# Altium schematic sheet PCI Express_16765X6890_98PIN_Low profile.schdoc: PCI Express x8 Top Sheet
size A4; SheetNumber: 1; SheetTotal: 2
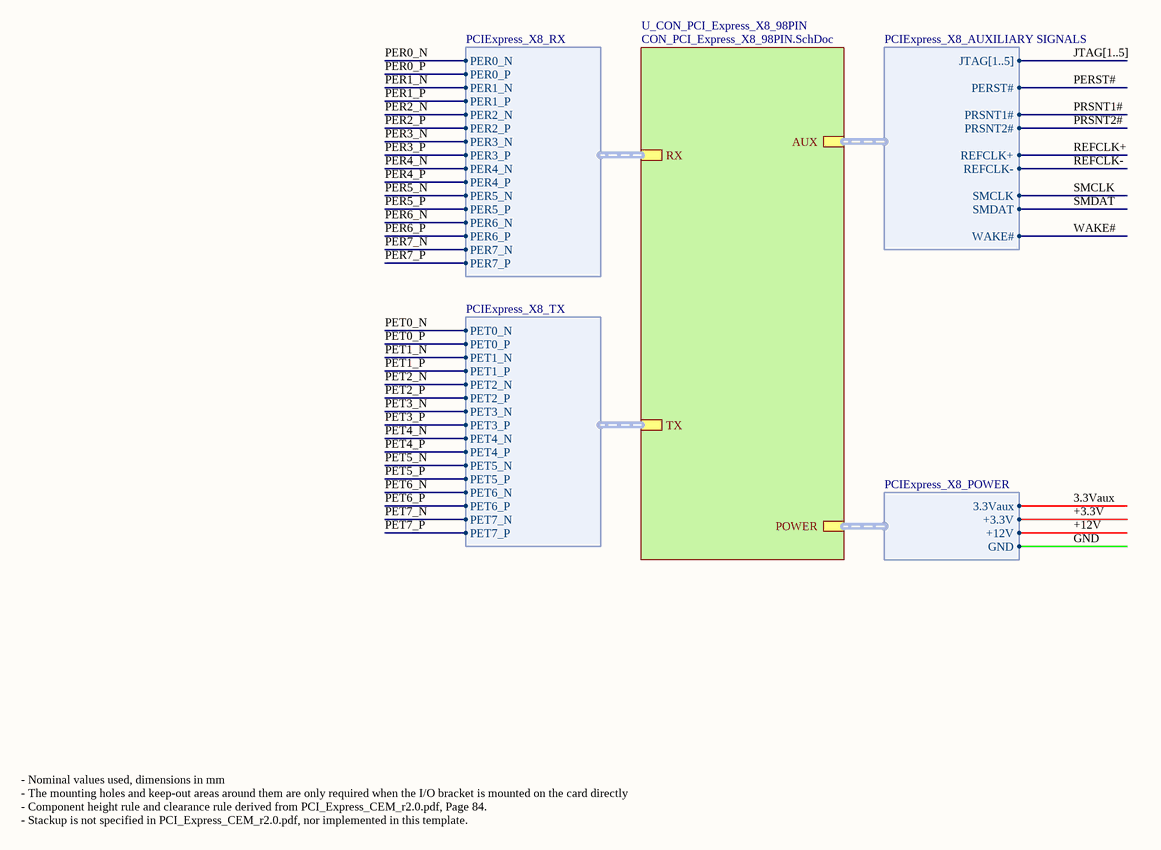
[diagram p0: PCI Express_16765X6890_98PIN_Low profile.schdoc]

## Sub-sheets
U_CON_PCI_Express_X8_98PIN = CON_PCI_Express_X8_98PIN.SchDoc: POWER (harness PCIExpress_X8_POWER), AUX (harness PCIExpress_X8_AUXILIARY SIGNALS), RX (harness PCIExpress_X8_RX), TX (harness PCIExpress_X8_TX)

## Harnesses
PCIExpress_X8_RX: PER0_N, PER0_P, PER1_N, PER1_P, PER2_N, PER2_P, PER3_N, PER3_P, PER4_N, PER4_P, PER5_N, PER5_P, PER6_N, PER6_P, PER7_N, PER7_P
PCIExpress_X8_TX: PET0_N, PET0_P, PET1_N, PET1_P, PET2_N, PET2_P, PET3_N, PET3_P, PET4_N, PET4_P, PET5_N, PET5_P, PET6_N, PET6_P, PET7_N, PET7_P
PCIExpress_X8_POWER: +3.3V, +12V, GND, 3.3Vaux
PCIExpress_X8_AUXILIARY SIGNALS: JTAG[1..5], PERST#, PRSNT1#, PRSNT2#, REFCLK+, REFCLK-, SMCLK, SMDAT, WAKE#

## Nets
3.3Vaux: sheet U_CON_PCI_Express_X8_98PIN/POWER.3.3Vaux
+3.3V: sheet U_CON_PCI_Express_X8_98PIN/POWER.+3.3V
+12V: sheet U_CON_PCI_Express_X8_98PIN/POWER.+12V
GND: sheet U_CON_PCI_Express_X8_98PIN/POWER.GND
PER0_N: sheet U_CON_PCI_Express_X8_98PIN/RX.PER0_N
PER0_P: sheet U_CON_PCI_Express_X8_98PIN/RX.PER0_P
PER1_N: sheet U_CON_PCI_Express_X8_98PIN/RX.PER1_N
PER1_P: sheet U_CON_PCI_Express_X8_98PIN/RX.PER1_P
PER2_N: sheet U_CON_PCI_Express_X8_98PIN/RX.PER2_N
PER2_P: sheet U_CON_PCI_Express_X8_98PIN/RX.PER2_P
PER3_N: sheet U_CON_PCI_Express_X8_98PIN/RX.PER3_N
PER3_P: sheet U_CON_PCI_Express_X8_98PIN/RX.PER3_P
PER4_N: sheet U_CON_PCI_Express_X8_98PIN/RX.PER4_N
PER4_P: sheet U_CON_PCI_Express_X8_98PIN/RX.PER4_P
PER5_N: sheet U_CON_PCI_Express_X8_98PIN/RX.PER5_N
PER5_P: sheet U_CON_PCI_Express_X8_98PIN/RX.PER5_P
PER6_N: sheet U_CON_PCI_Express_X8_98PIN/RX.PER6_N
PER6_P: sheet U_CON_PCI_Express_X8_98PIN/RX.PER6_P
PER7_N: sheet U_CON_PCI_Express_X8_98PIN/RX.PER7_N
PER7_P: sheet U_CON_PCI_Express_X8_98PIN/RX.PER7_P
PERST#: sheet U_CON_PCI_Express_X8_98PIN/AUX.PERST#
PET0_N: sheet U_CON_PCI_Express_X8_98PIN/TX.PET0_N
PET0_P: sheet U_CON_PCI_Express_X8_98PIN/TX.PET0_P
PET1_N: sheet U_CON_PCI_Express_X8_98PIN/TX.PET1_N
PET1_P: sheet U_CON_PCI_Express_X8_98PIN/TX.PET1_P
PET2_N: sheet U_CON_PCI_Express_X8_98PIN/TX.PET2_N
PET2_P: sheet U_CON_PCI_Express_X8_98PIN/TX.PET2_P
PET3_N: sheet U_CON_PCI_Express_X8_98PIN/TX.PET3_N
PET3_P: sheet U_CON_PCI_Express_X8_98PIN/TX.PET3_P
PET4_N: sheet U_CON_PCI_Express_X8_98PIN/TX.PET4_N
PET4_P: sheet U_CON_PCI_Express_X8_98PIN/TX.PET4_P
PET5_N: sheet U_CON_PCI_Express_X8_98PIN/TX.PET5_N
PET5_P: sheet U_CON_PCI_Express_X8_98PIN/TX.PET5_P
PET6_N: sheet U_CON_PCI_Express_X8_98PIN/TX.PET6_N
PET6_P: sheet U_CON_PCI_Express_X8_98PIN/TX.PET6_P
PET7_N: sheet U_CON_PCI_Express_X8_98PIN/TX.PET7_N
PET7_P: sheet U_CON_PCI_Express_X8_98PIN/TX.PET7_P
PRSNT1#: sheet U_CON_PCI_Express_X8_98PIN/AUX.PRSNT1#
PRSNT2#: sheet U_CON_PCI_Express_X8_98PIN/AUX.PRSNT2#
REFCLK+: sheet U_CON_PCI_Express_X8_98PIN/AUX.REFCLK+
REFCLK-: sheet U_CON_PCI_Express_X8_98PIN/AUX.REFCLK-
SMCLK: sheet U_CON_PCI_Express_X8_98PIN/AUX.SMCLK
SMDAT: sheet U_CON_PCI_Express_X8_98PIN/AUX.SMDAT
WAKE#: sheet U_CON_PCI_Express_X8_98PIN/AUX.WAKE#

## Buses and harness runs
bus JTAG[1..5]

## Notes on the sheet
- - Nominal values used, dimensions in mm
  - The mounting holes and keep-out areas around them are only required when the I/O bracket is mounted on the card directly
  - Component height rule and clearance rule derived from PCI_Express_CEM_r2.0.pdf, Page 84.
  - Stackup is not specified in PCI_Express_CEM_r2.0.pdf, nor implemented in this template.
- Sheet Title
- Project Title
- Size:
- Date:
- A4
- Item:
- Time:
- Revision:
- Sheet
- of
- File: